# EAGLE design CanLogger_V2 (EAGLE 7.4.0)
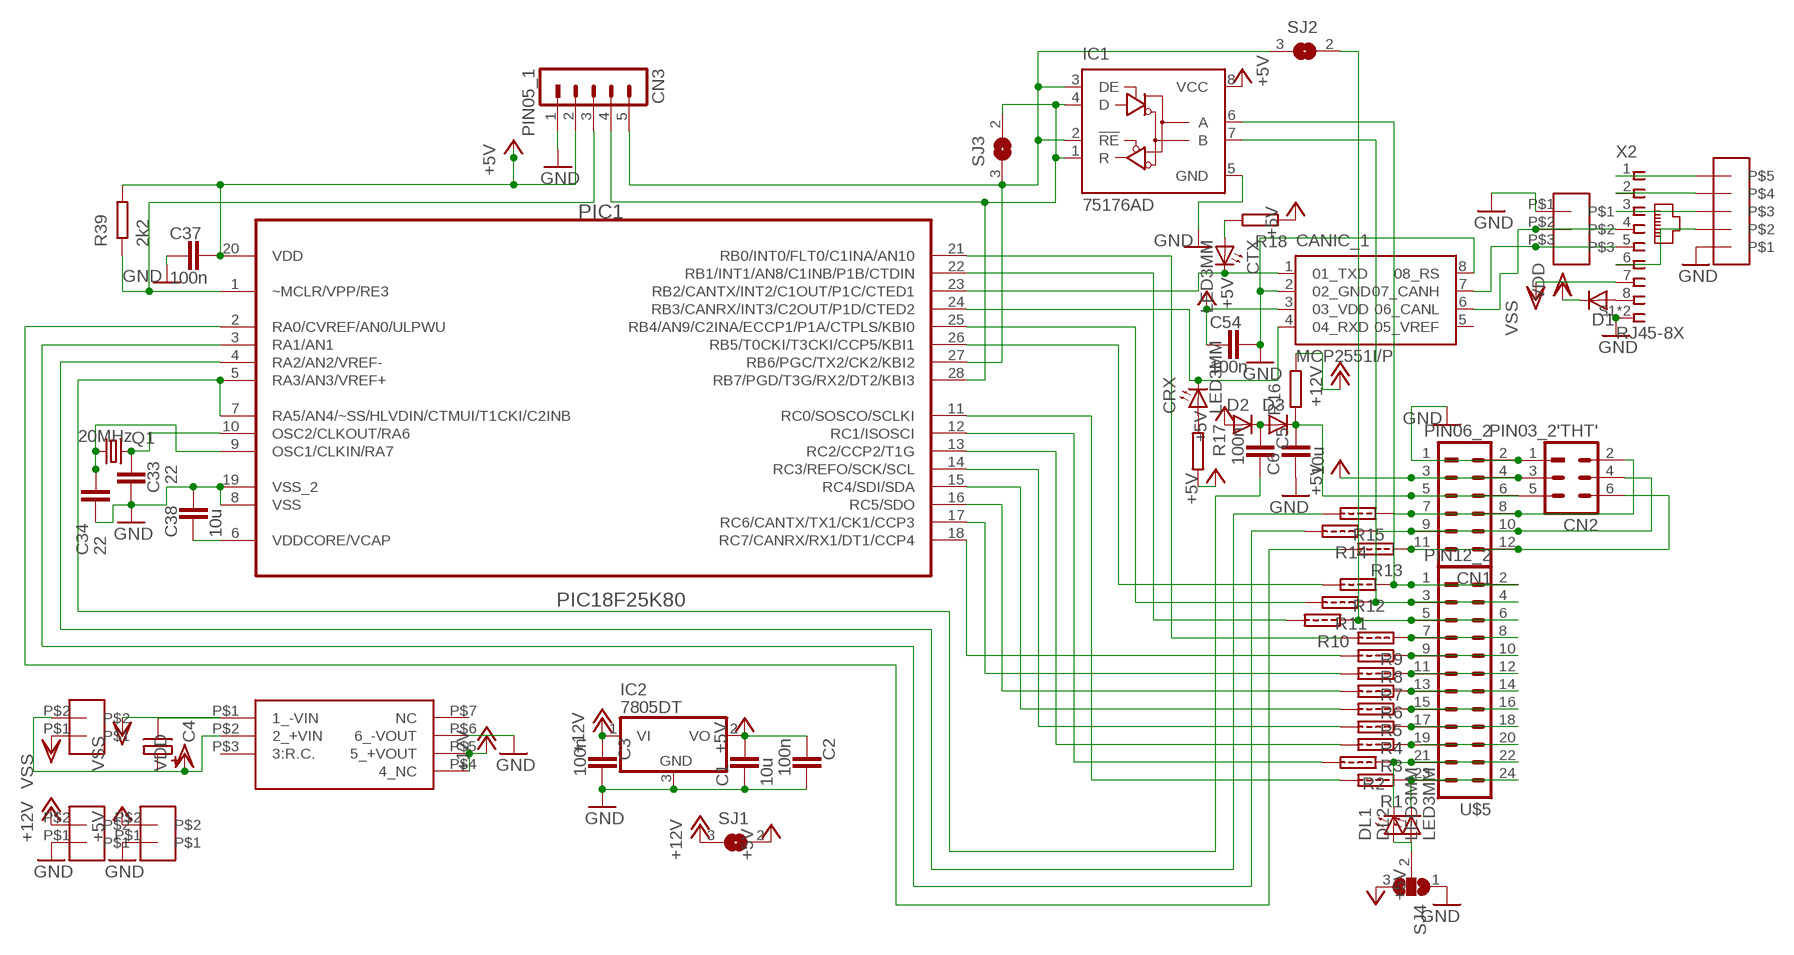
[diagram p0: schematic, sheet 1]

## Parts
C1  10u  C0805  [R0805]
C2  100n  C0805  [R0805]
C3  100n  C0805  [R0805]
C4  C_EL1R05  [C_EL1RASZT05]
C5  100n  C0805  [R0805]
C6  10u  C0805  [R0805]
C33  22  C0805  [R0805]
C34  22  C0805  [R0805]
C37  100n  C0805  [R0805]
C38  10u  C0805  [R0805]
C54  100n  C0805  [R0805]
CANIC_1  MCP2551I/P  [DIL_8]
CN1  PIN06_2  [PIN06_2]
CN2  PIN03_2'THT'  [PIN03_2]
CN3  PIN05_1  [PIN05_1]
CN_CAN  FEHER_TUS_3  [FEHER_TUS_3]
CRX  LED3MM  [LED3MM]
CTX  LED3MM  [LED3MM]
D1  D1R  [D1RASZT]
D2  D0805  [D0805]
D3  D0805  [D0805]
DL1  LED3MM  [LED3MM]
DL2  LED3MM  [LED3MM]
IC1  75176AD  [D_R-PDSO-G8]
IC2  7805DT  [TO252]
PIC1  PIC18F25K80  [SOIC127P1030X265-28N]
Q1  20MHz  XTAL_2QS  [XTAL_QS]
R1  RNULL_EU0805  [R0805_C]
R2  RNULL_EU0805  [R0805_C]
R3  RNULL_EU0805  [R0805_C]
R4  RNULL_EU0805  [R0805_C]
R5  RNULL_EU0805  [R0805_C]
R6  RNULL_EU0805  [R0805_C]
R7  RNULL_EU0805  [R0805_C]
R8  RNULL_EU0805  [R0805_C]
R9  RNULL_EU0805  [R0805_C]
R10  RNULL_EU0805  [R0805_C]
R11  RNULL_EU0805  [R0805_C]
R12  RNULL_EU0805  [R0805_C]
R13  RNULL_EU0805  [R0805_C]
R14  RNULL_EU0805  [R0805_C]
R15  RNULL_EU0805  [R0805_C]
R16  R_EU0805  [R0805]
R17  R_EU0805  [R0805]
R18  R_EU0805  [R0805]
R39  2k2  R_EU0805  [R0805]
SJ1  SJ  [SJ]
SJ2  SJ  [SJ]
SJ3  SJ  [SJ]
SJ4  SJ2W  [SJ2]
U$1  FEHER_TUS_5  [FEHER_TUS_5]
U$2  FEHER_TUS_2ALLO  [FEHER_TUS_2]
U$3  FEHER_TUS_2ALLO  [FEHER_TUS_2]
U$4  FEHER_TUS_2ALLO  [FEHER_TUS_2]
U$5  PIN12_2  [PIN12_2]
U$6  SPA02C  [SPA02C]
X2  RJ45-8X  [RJ45]

## Nets
+5V: C1.1 C2.2 C37.1 C54.2 CANIC_1.3(03_VDD) CN1.3 CN1.4 CN2.3 CN3.2 D2.1(A) IC1.8(VCC) IC2.2(VO) PIC1.20(VDD) R17.2(E) R18.1(A) R39.2(E) SJ1.2 SJ4.3 U$4.P$2
+12V: C3.2 IC2.1(VI) R16.2(E) SJ1.3 U$3.P$2 U$6.P$4(4_NC) U$6.P$5(5_+VOUT)
GND: C1.2 C2.1 C3.1 C6.2 C33.2 C34.2 C37.2 C38.1 C54.1 CANIC_1.2(02_GND) CANIC_1.8(08_RS) CN1.1 CN1.2 CN2.1 CN3.1 CN_CAN.P$1 IC1.5(GND) IC2.3(GND) PIC1.8(VSS) PIC1.19(VSS_2) SJ4.1 U$1.P$1 U$3.P$1 U$4.P$1 U$6.P$6(6_-VOUT) X2.S1(S) X2.S2(S)
N$1: CANIC_1.7(07_CANH) CN_CAN.P$3 X2.5
N$2: IC1.7(B) R11.1(A) U$5.3 U$5.4
N$3: CANIC_1.6(06_CANL) CN_CAN.P$2 X2.4
N$4: CN3.3 PIC1.1(~MCLR/VPP/RE3) R39.1(A)
N$5: IC1.6(A) R12.1(A) U$5.1 U$5.2
N$6: R10.1(A) SJ2.2 U$5.5 U$5.6
N$7: CANIC_1.1(01_TXD) CTX.K(C) PIC1.23(RB2/CANTX/INT2/C1OUT/P1C/CTED1)
N$8: D1.P$1(A) X2.8
N$9: DL1.K(C) R2.1(A) U$5.21 U$5.22
N$10: R3.1(A) U$5.19
N$11: R4.1(A) U$5.17 U$5.18
N$12: R5.1(A) U$5.15 U$5.16
N$13: DL1.A DL2.A SJ4.2
N$14: R6.1(A) U$5.13 U$5.14
N$15: R7.1(A) U$5.11 U$5.12
N$16: R8.1(A) U$5.9 U$5.10
N$17: R9.1(A) U$5.7 U$5.8
N$18: CRX.A R17.1(A)
N$19: CTX.A R18.2(E)
N$20: CN1.11 CN1.12 CN2.6 R13.1(A)
N$21: CN1.9 CN1.10 CN2.4 R14.1(A)
N$22: CN1.7 CN1.8 CN2.2 R15.1(A)
N$23: C5.2 D2.2(C) D3.1(A)
N$24: C6.1 CN1.5 CN1.6 CN2.5 D3.2(C) R16.1(A)
N$31: DL2.K(C) R1.1(A) U$5.23 U$5.24
N$32: PIC1.26(RB5/T0CKI/T3CKI/CCP5/KBI1) R12.2(E)
N$33: PIC1.18(RC7/CANRX/RX1/DT1/CCP4) R8.2(E)
N$34: PIC1.17(RC6/CANTX/TX1/CK1/CCP3) R7.2(E)
N$35: C33.1 PIC1.10(OSC2/CLKOUT/RA6) Q1.2
N$36: PIC1.16(RC5/SDO) R6.2(E)
N$37: PIC1.15(RC4/SDI/SDA) R5.2(E)
N$38: PIC1.14(RC3/REFO/SCK/SCL) R4.2(E)
N$39: PIC1.13(RC2/CCP2/T1G) R3.2(E)
N$40: PIC1.12(RC1/ISOSCI) R2.2(E)
N$41: PIC1.11(RC0/SOSCO/SCLKI) R1.2(E)
N$43: CANIC_1.4(04_RXD) CRX.K(C) PIC1.24(RB3/CANRX/INT3/C2OUT/P1D/CTED2)
N$44: PIC1.4(RA2/AN2/VREF-) R15.2(E)
N$45: C5.1 PIC1.5(RA3/AN3/VREF+) PIC1.7(RA5/AN4/~SS/HLVDIN/CTMUI/T1CKI/C2INB)
N$47: PIC1.21(RB0/INT0/FLT0/C1INA/AN10) R9.2(E)
N$48: PIC1.22(RB1/INT1/AN8/C1INB/P1B/CTDIN) R10.2(E)
N$49: U$1.P$5 X2.1
N$50: U$1.P$4 X2.2
N$51: U$1.P$3 X2.3
N$52: PIC1.2(RA0/CVREF/AN0/ULPWU) R13.2(E)
N$53: U$1.P$2 X2.6
N$54: PIC1.3(RA1/AN1) R14.2(E)
N$55: PIC1.25(RB4/AN9/C2INA/ECCP1/P1A/CTPLS/KBI0) R11.2(E)
N$56: U$5.20
N$81: C34.1 PIC1.9(OSC1/CLKIN/RA7) Q1.1
N$188: CN3.5 IC1.2(!RE) IC1.3(DE) PIC1.27(RB6/PGC/TX2/CK2/KBI2) SJ2.3 SJ3.3
N$223: C38.2 PIC1.6(VDDCORE/VCAP)
N$357: CN3.4 IC1.1(R) IC1.4(D) PIC1.28(RB7/PGD/T3G/RX2/DT2/KBI3) SJ3.2
VDD: C4.P+ D1.P$2(C) U$2.P$2 U$6.P$2(2_+VIN)
VSS: C4.P- U$2.P$1 U$6.P$1(1_-VIN) X2.7
Unconnected: CANIC_1.5(05_VREF) U$6.P$3(3:R.C.) U$6.P$7(NC)

## Library data of the parts
C1-C3 C5 C6 C33 C34 C37 C38 C54 = Cf_RLCPX:C
C4 = Cf_RLCPX:C_EL
CANIC_1 = Cf_UC:MCP2551
CN1 = Cf_Csatl:PIN06_2
CN2 = Cf_Csatl:PIN03_2
CN3 = Cf_Csatl:PIN05_1
CN_CAN = csatik:FEHER_TUS_3
CRX CTX DL1 DL2 = Cf_Felv:LED
D1-D3 = Cf_Felv:D
IC1 = narval:75176A: DIFFERENTIAL BUS TRANSCEIVER Source: http://focus.ti.com/lit/ds/symlink/sn75176a.pdf
IC2 = narval:78*: Positive VOLTAGE REGULATOR Source: http://cache.national.com/ds/LM/LM78L05.pdf http://www.fairchildsemi.com/ds/LM/LM7805.pdf
PIC1 = narval:PIC18F25K80
Q1 = Cf_RLCPX:XTAL_2
R1-R15 = Cf_RLCPX:RNULL_EU
R16-R18 R39 = Cf_RLCPX:R_EU
SJ1-SJ3 = jumper2:SJ: SMD solder JUMPER
SJ4 = jumper:SJ2W: SMD solder JUMPER
U$1 = csatik:FEHER_TUS_5
U$2-U$4 = csatik:FEHER_TUS_2
U$5 = Cf_Csatl:PIN12_2
U$6 = narval:SPA02C
X2 = Cf_Csatl:RJ45: CORCOM Modular RJ Jacks No Shield Source: www.tycoelectronics.com .. ENG_DS_1654001_1099_RJ_L_0507.pdf; MPN: RJ45-8X; OC_FARNELL: unknown; OC_NEWARK: 16R6101

## Net classes
0 default: width 0.305 mm, drill 0.61 mm, clearance 0.305 mm

## Board
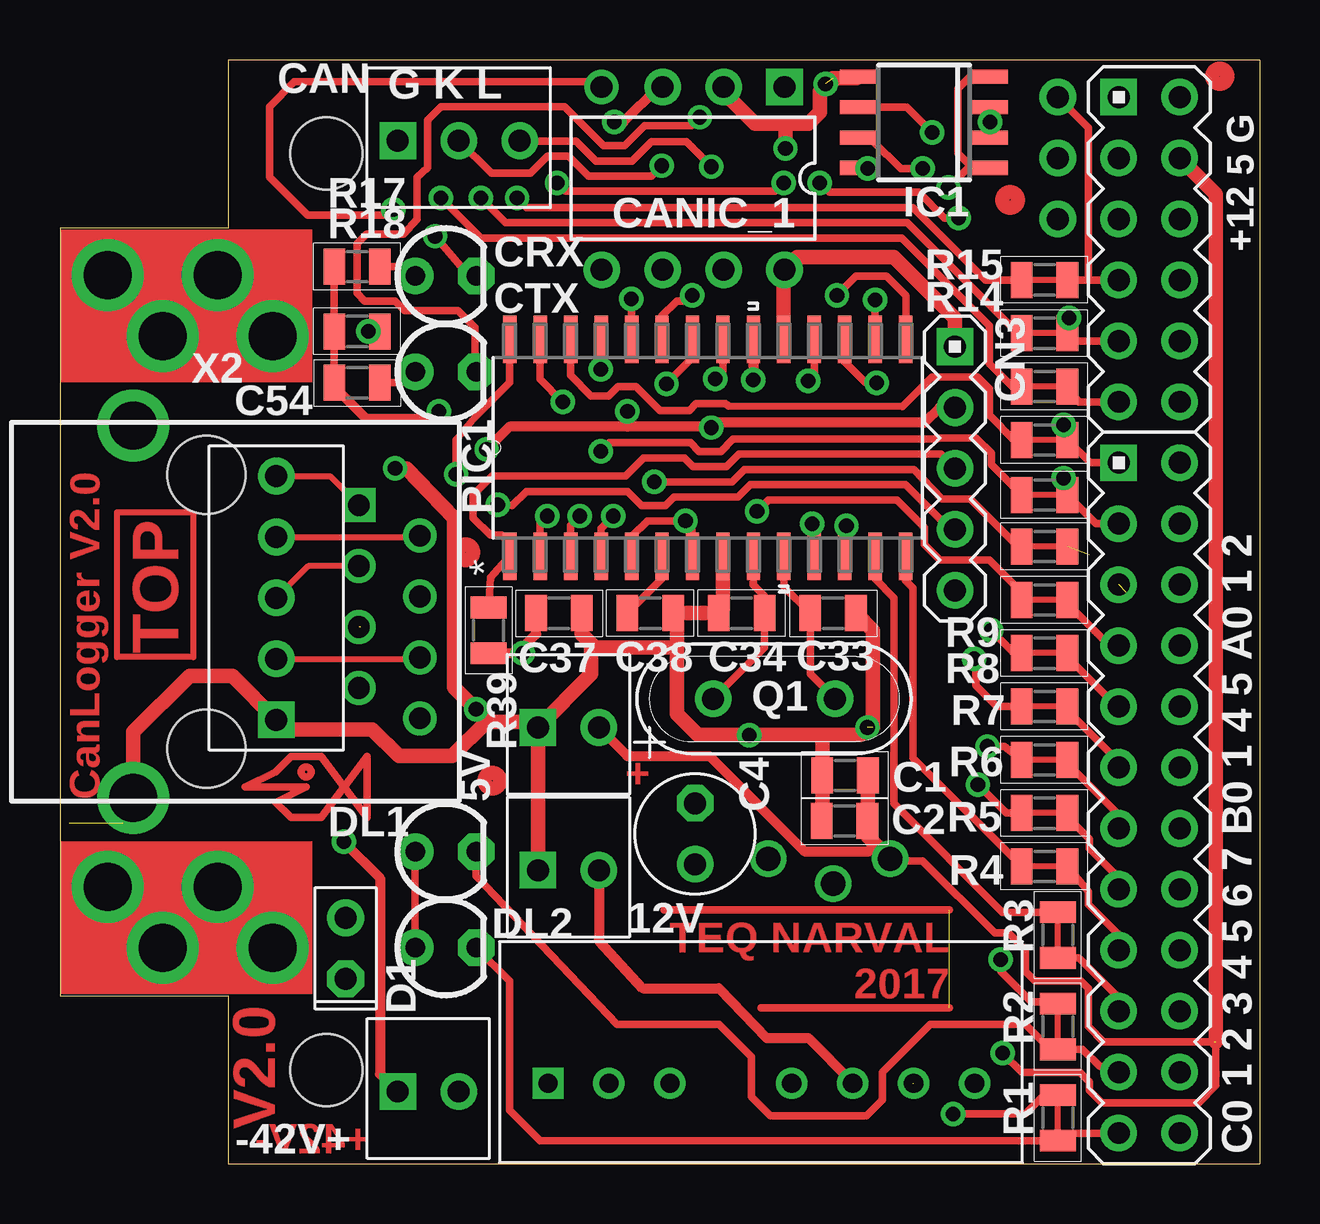
[diagram p1: board, top side]
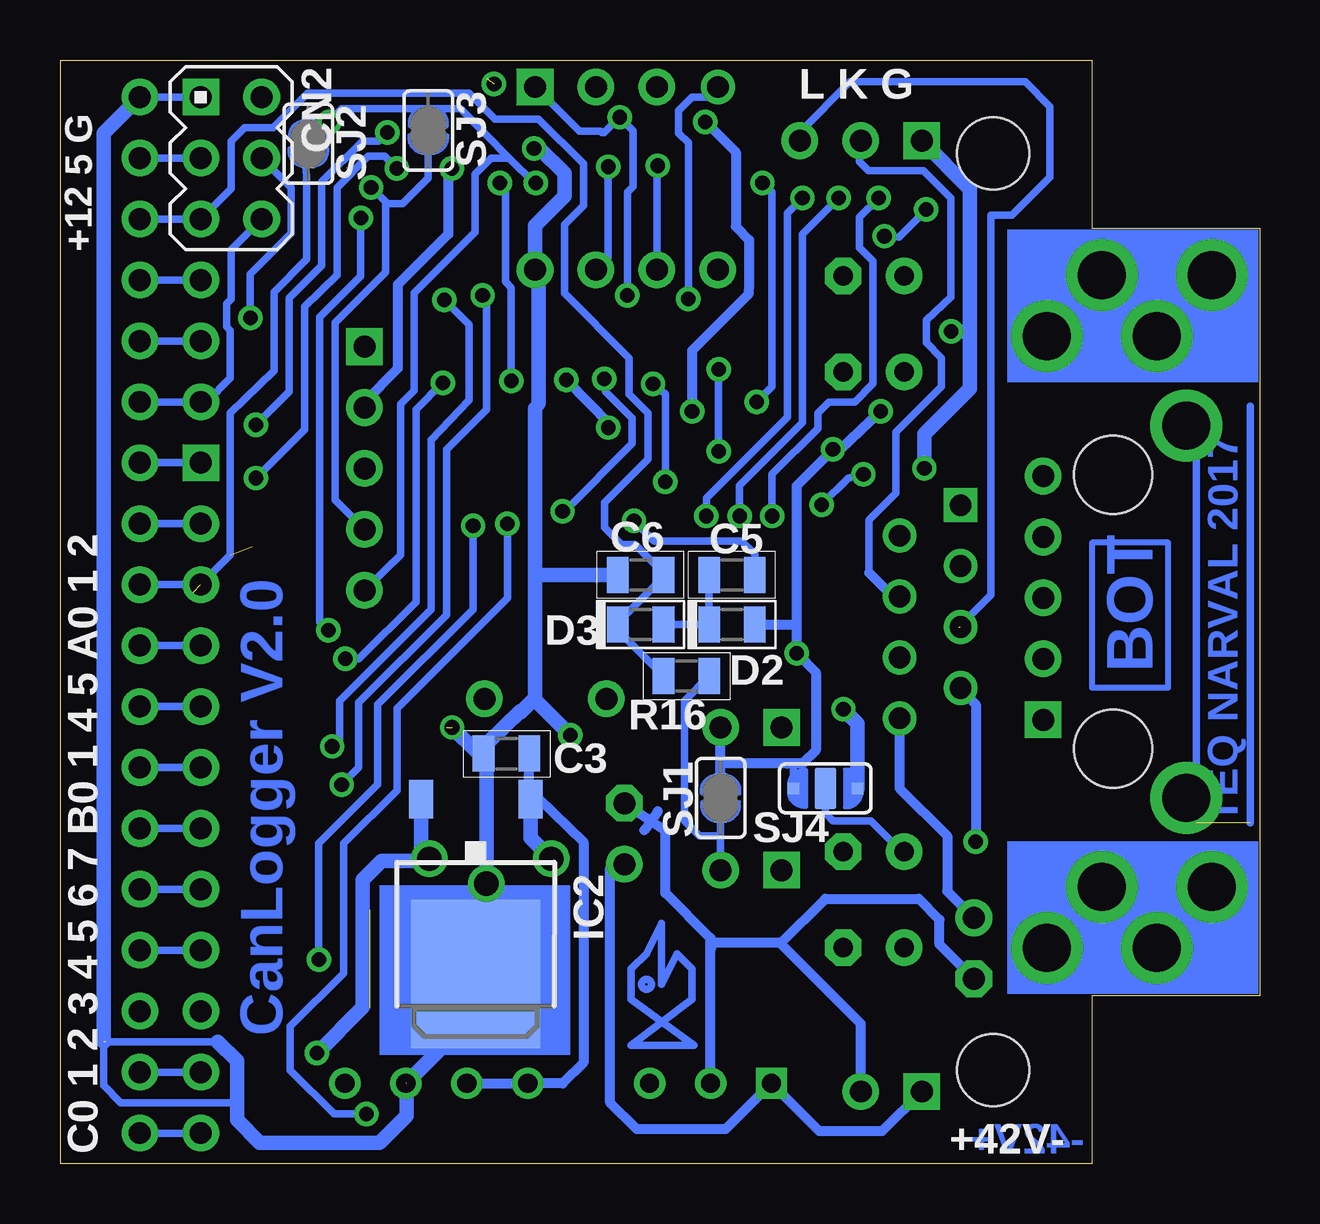
[diagram p2: board, bottom side, seen from below]

Size 50 x 46 mm. Coordinates in mm from the lower left corner, seen from the top.
Outline: 7,0 50,0 50,46 7,46 7,39 0,39 0,7 7,7 7,0
Copper layers (1*16): Top 0.035mm / dielectric 1.5mm / Bottom 0.035mm
Design rules "default *": minimum track width 10mil, minimum drill 24mil, track to track 12mil, track to pad 12mil, pad to pad 12mil, via to via 1mil, smd to smd 0mil, copper to edge 24mil, drill to drill 8mil, minimum pad ring 10mil, minimum via ring 8mil, stop-mask expansion 4mil, vias tented up to drill 0mil, thermal gap 10mil
Holes 3 mm at 11.1,3.9 11.1,42.1

### Footprints (pad centres in the part's own frame; a part is rotated, then mirrored left to right if it is on the bottom)
R0805 = smd 0.9 x 1.5: 1 -0.953,0; 2 0.953,0
C_EL1RASZT05 = drill 0.914 pad 1.524 octagon: P+ 1.27,0 | drill 0.914 pad 1.524: P- -1.27,0
DIL_8 = drill 0.914 pad 1.524 square: 1 -3.81,-3.81 | drill 0.914 pad 1.524: 2 -1.27,-3.81; 3 1.27,-3.81; 5 3.81,3.81; 6 1.27,3.81; 7 -1.27,3.81; 8 -3.81,3.81 | drill 0.914: 4 3.81,-3.81
PIN06_2 = drill 0.914 pad 1.524 square: 1 -5.08,0 | drill 0.914 pad 1.524: 2 -5.08,2.54; 3 -2.54,0; 4 -2.54,2.54; 5 0,0; 6 0,2.54; 7 2.54,0; 8 2.54,2.54; 9 5.08,0; 10 5.08,2.54; 11 7.62,0; 12 7.62,2.54
PIN03_2 = drill 0.914 pad 1.524 square: 1 -2.54,0 | drill 0.914 pad 1.524: 2 -2.54,2.54; 3 0,0; 4 0,2.54; 5 2.54,0; 6 2.54,2.54
PIN05_1 = drill 0.914 pad 1.524 square: 1 -5.08,0 | drill 0.914 pad 1.524: 2 -2.54,0; 3 0,0; 4 2.54,0; 5 5.08,0
FEHER_TUS_3 = drill 0.914 pad 1.524 square: P$1 0,0 | drill 0.914 pad 1.524: P$2 2.54,0; P$3 5.08,0
LED3MM = drill 0.813 pad 1.524: A -1.27,0 | drill 0.813 pad 1.524 octagon: K 1.27,0
D1RASZT = drill 0.914 pad 1.524: P$1 -1.27,0 | drill 0.914 pad 1.524 octagon: P$2 1.27,0
D0805 = smd 0.9 x 1.5: 1 -0.953,0; 2 0.953,0
D_R-PDSO-G8 = smd 0.6 x 1.5: 1 -1.905,-2.75; 2 -0.635,-2.75; 3 0.635,-2.75; 4 1.905,-2.75; 5 1.905,2.75; 6 0.635,2.75; 7 -0.635,2.75; 8 -1.905,2.75
TO252 = smd 1 x 1.6: 1 -2.28,-4.8; 2 2.28,-4.8 | smd 5.4 x 6.2: 3 0,2.5
SOIC127P1030X265-28N = smd 1.981 x 0.559: 1 -4.521,8.255; 2 -4.521,6.985; 3 -4.521,5.715; 4 -4.521,4.445; 5 -4.521,3.175; 6 -4.521,1.905; 7 -4.521,0.635; 8 -4.521,-0.635; 9 -4.521,-1.905; 10 -4.521,-3.175; 11 -4.521,-4.445; 12 -4.521,-5.715; 13 -4.521,-6.985; 14 -4.521,-8.255; 15 4.521,-8.255; 16 4.521,-6.985; 17 4.521,-5.715; 18 4.521,-4.445; 19 4.521,-3.175; 20 4.521,-1.905; 21 4.521,-0.635; 22 4.521,0.635; 23 4.521,1.905; 24 4.521,3.175; 25 4.521,4.445; 26 4.521,5.715; 27 4.521,6.985; 28 4.521,8.255
XTAL_QS = drill 0.914 pad 1.524: 1 -2.54,0; 2 2.54,0
R0805_C = smd 0.9 x 1.5: 1 -0.953,0; 2 0.953,0
SJ = smd 0.508 x 0.508: 1 -0.762,0; 2 0.762,0; 3 -0.762,0; 4 0.762,0
SJ2 = smd 0.508 x 0.508: 1 -1.333,0; 3 1.333,0 | smd 0.889 x 1.714: 2 0,0
FEHER_TUS_5 = drill 0.914 pad 1.524 square: P$1 5.08,0 | drill 0.914 pad 1.524: P$2 2.54,0; P$3 0,0; P$4 -2.54,0; P$5 -5.08,0
FEHER_TUS_2 = drill 0.914 pad 1.524 square: P$1 0,0 | drill 0.914 pad 1.524: P$2 2.54,0
PIN12_2 = drill 0.914 pad 1.524 square: 1 -12.7,0 | drill 0.914 pad 1.524: 2 -12.7,2.54; 3 -10.16,0; 4 -10.16,2.54; 5 -7.62,0; 6 -7.62,2.54; 7 -5.08,0; 8 -5.08,2.54; 9 -2.54,0; 10 -2.54,2.54; 11 0,0; 12 0,2.54; 13 2.54,0; 14 2.54,2.54; 15 5.08,0; 16 5.08,2.54; 17 7.62,0; 18 7.62,2.54; 19 10.16,0; 20 10.16,2.54; 21 12.7,0; 22 12.7,2.54; 23 15.24,0; 24 15.24,2.54
SPA02C = drill 0.8 square: P$1 2.024,3.294 | drill 0.8: P$2 4.564,3.294; P$3 7.104,3.294; P$4 12.184,3.294; P$5 14.724,3.294; P$6 17.264,3.294; P$7 19.804,3.294
RJ45 = drill 0.9 pad 1.4 square: 1 -4.445,6.35 | drill 0.9 pad 1.4: 2 -3.175,8.89; 3 -1.905,6.35; 4 -0.635,8.89; 5 0.635,6.35; 6 1.905,8.89; 7 3.175,6.35; 8 4.445,8.89 | drill 2: S1 -7.77,-3.05; S2 7.77,-3.05 | hole 3.251: -5.715,0; 5.715,0

### Placement (x,y rotation side)
C1  32.73,16.18 180 top
C2  32.7,14.29 0 top
C3  31.39,17.08 0 bottom
C4  26.47,13.74 90 top
C5  21.99,24.53 180 bottom
C6  25.8,24.53 180 bottom
C33  32.23,22.94 0 top
C34  28.42,22.94 180 top
C37  20.8,22.94 0 top
C38  24.61,22.94 180 top
C54  12.38,34.69 180 top
CANIC_1  26.39,41.07 180 top
CN1  44.13,39.37 270 top
CN2  44.13,41.91 270 bottom
CN3  37.31,28.97 270 top
CN_CAN  14.08,42.63 0 top
CRX  16.08,37 0 top
CTX  16.08,33 0 top
D1  11.91,8.97 270 top
D2  21.99,22.46 180 bottom
D3  25.8,22.46 180 bottom
DL1  16.08,13 0 top
DL2  16.08,9 0 top
IC1  36.02,43.4 90 top
IC2  32.67,10.39 180 bottom
PIC1  27,29.84 90 top
Q1  29.77,19.37 0 top
R1  41.59,1.91 90 top
R2  41.59,5.71 90 top
R3  41.59,9.53 90 top
R4  41.04,12.38 180 top
R5  41.04,14.61 180 top
R6  41.04,16.83 180 top
R7  41.04,19.05 180 top
R8  41.04,21.27 180 top
R9  41.04,23.5 180 top
R10  41.04,25.72 180 top
R11  41.04,27.86 180 top
R12  41.04,30.16 180 top
R13  41.04,32.38 180 top
R14  41.04,34.61 180 top
R15  41.04,36.83 180 top
R16  23.89,20.32 0 bottom
R17  12.38,37.39 180 top
R18  12.38,32.54 0 top
R39  17.86,22.23 270 top
SJ1  22.46,15.24 90 bottom
SJ2  39.65,42.51 270 bottom
SJ3  34.65,43.06 270 bottom
SJ4  18.1,15.64 180 bottom
U$1  9.02,23.57 270 top
U$2  14.08,3 0 top
U$3  19.92,12.22 0 top
U$4  19.92,18.18 0 top
U$5  44.13,16.51 270 top
U$6  18.32,0.05 0 top
X2  6.11,23 270 top

### Tracks (layer width: path | path; a pad name or v marks a point on that pad's centre or on a via)
+5V  (via drill 0.61, 1.02)  (1 unrouted)
  Top 0.305: v39.29,4.6 40.08,3.81 42.51,3.81 42.9,3.41 42.9,3.06 43.42,2.54 47.47,2.54 48.18,3.25 48.18,5.08 | R17.2 C54.2 R18.1 | 34.92,12.62 35.96,12.62 38.97,9.6 39.53,9.6 40.24,8.89 40.24,8.02 40.64,7.62 42.55,7.62 42.86,7.3 42.86,5.71 43.5,5.08 48.1,5.08
  Top 0.406: CN3.2 36.67,31.51 36.03,30.88 27.3,30.88 27.27,30.8 v27.15,30.68 26.99,30.72 23.65,30.72 | R39.2 v19.29,21.27 19.29,21.51 19.84,22.07 C37.1 | PIC1.20 28.91,33.27 v28.89,32.66 | 23.65,30.72 18.73,30.72 v17.78,29.77 | v33.66,41.47 33.21,41.43 IC1.8 | CANIC_1.3 25.09,44.85 24.92,44.85 23.5,43.42 v23.1,43.42 | v23.65,31.35 23.65,30.72 | U$4.P$2 23.65,16.99 27.07,16.99 31.04,13.02 33.73,13.02 33.93,13.38 | v15.8,31.35 15.48,31.04 12.78,31.04 11.43,32.38 R18.1
  Top 0.61: C1.1 33.68,13.83 C2.2 33.66,13.65 33.93,13.38 34.69,12.62 34.92,12.62 v34.61,12.7 | CN1.4 48.18,40.4 48.18,5.08
  Bottom 0.305: CN2.3 CN1.4 | SJ4.3 19.43,16.65 19.68,16.67
  Bottom 0.406: SJ1.2 22.46,16.67 | 19.29,22.46 v19.29,21.27 18.49,20.48 18.49,17.22 19.05,16.67 19.68,16.67 22.46,16.67 | 19.29,22.46 19.29,28.26 v17.78,29.77 17.46,29.77 v15.8,31.35 | v28.89,32.66 27.07,30.8 v27.15,30.68 | D2.1 19.29,22.46 | v23.1,43.42 21.83,42.15 21.83,39.05 21.27,38.5 21.27,36.67 21.31,36.23 23.65,33.89 v23.65,31.35 | v33.66,41.47 33.82,41.31 33.82,38.73 35.91,36.65 35.91,33.15 37.31,31.75 CN3.2 | 22.46,16.67 U$4.P$2
  Bottom 0.61: IC2.2 34.95,12.67 v34.61,12.7 34.92,13.02 | v39.29,4.6 37.39,6.51 37.39,11.83 36.59,12.62 35.24,12.62
+12V  (via drill 1.02)
  Top 0.406: U$3.P$2 22.46,9.29 24.29,7.3 27.46,7.3 29.45,5.24 31.19,5.24 33.04,3.39 U$6.P$5
  Bottom 0.305: C3.2 30.43,15.19 | R16.2 23.97,19.29 23.97,14.29 23.34,13.65 22.46,13.65 | SJ1.3 22.46,13.65 | 22.46,13.65 U$3.P$2
  Bottom 0.406: 30.43,15.19 IC2.1 | C3.2 30.44,15.28 30.4,15.24 30.08,15.24 28.18,13.41 28.18,4.21 29.04,3.34 U$6.P$4 U$6.P$5
  Bottom 0.61: v29.53,12.7 30.39,13.56 IC2.1
GND  (via drill 0.61, 1.02)  (3 unrouted)
  Top 0.305: C38.1 25.72,22.78 | C34.2 27.64,23.11
  Top 0.61: C33.2 33.89,22.23 33.89,18.18 | 31.67,17.86 v28.73,17.86 26.59,17.86 25.72,18.73 25.72,21.51 | 25.72,21.51 25.72,22.78 | C34.2 C38.1 | 27.64,23.11 PIC1.8 | C37.2 21.75,22.07 22.15,21.67 | 22.15,21.67 22.3,21.51 25.72,21.51 | U$4.P$1 U$3.P$1 | U$4.P$1 22.15,20.4 22.15,21.67 | PIC1.19 30.16,34.38 30.16,37.22 CANIC_1.8 30.73,37.78 34.77,37.78 37.31,35.24 CN3.1 | CANIC_1.2 27.66,44.65 28.97,43.34 30.16,43.34 | 30.16,43.34 31.19,43.34 31.67,43.81 31.67,44.69 32.23,45.24 33.21,45.24 IC1.5 | 17.86,18.41 v17.34,18.93 16.43,19.84 16.43,26.91 14.45,28.97 v13.97,28.97 | 17.86,18.41 19.68,18.41 U$4.P$1 | v30.24,42.31 30.24,43.26 30.16,43.34 | C2.1 31.77,13.83 C1.2 31.77,17.76 31.67,17.86 | C54.1 v12.86,34.69 | X2.S2 3.06,17.98 5.4,20.32 7.19,20.32 U$1.P$1 9.05,18.5 9.45,18.1 13.02,18.1 14.13,16.99 16.35,16.99 17.78,18.41 17.86,18.41 | v33.66,18.18 33.34,17.86 31.67,17.86
  Bottom 0.305: CN2.1 CN1.2 | 43.42,5.08 48.1,5.08 | 42.62,2.54 47.47,2.54 48.18,3.25 48.18,5.08
  Bottom 0.61: U$6.P$6 32.67,6.25 IC2.3 32.23,8.34 v32.23,11.67 32.23,16.97 C3.1 | C3.1 32.34,17.34 32.15,17.54 30.8,18.87 30.8,18.81 30.24,19.37 | 30.24,19.37 30.2,19.41 30.2,24.53 | 30.2,24.53 30.2,31.47 30.04,31.67 30.04,37.1 CANIC_1.8 30.2,39.09 28.97,40.32 28.97,41.27 30,42.31 v30.24,42.31 | v28.73,17.86 30.24,19.37 | C6.2 30.2,24.53 | CN_CAN.P$1 12.06,40.62 12.06,34.77 | 12.06,34.77 12.06,32.31 13.97,30.4 v13.97,28.97 | v12.86,34.69 12.14,34.69 12.06,34.77 | 35.56,3.33 35.56,1.98 36.67,0.87 41.67,0.87 42.62,1.83 42.62,2.54 42.62,4.29 43.42,5.08 | 48.18,5.08 48.18,42.94 CN1.2 | SJ4.1 16.76,18.35 v17.34,18.93 | v33.66,18.18 32.56,17.08 C3.1
  other vias: 31.91,45.01
HALACSKA9
  Bottom 0.305: 26.19,4.93 23.57,4.93 26.19,6.83 26.19,8.11 25.56,8.74 24.92,10.01 24.92,7.47 24.29,8.74 23.65,8.11 23.65,6.83 26.19,4.93
HALACSKA14
  Top 0.305: 12.8,16.97 12.8,14.43 10.89,16.97 9.62,16.97 8.99,16.33 7.72,15.7 10.26,15.7 8.99,15.06 9.62,14.43 10.89,14.43 12.8,16.97
N$1  (via drill 0.61)  (1 unrouted)
  Top 0.305: CN_CAN.P$3 21.51,42.62 22.34,41.79 23.85,41.79 24.65,42.59 26.11,42.59 v27.15,41.55
  Bottom 0.305: v27.15,41.55 27.15,37.77 CANIC_1.7 | CN_CAN.P$3 19.16,42.99 17.07,45.09 9.76,45.09 8.73,44.05 8.73,41.12 10.32,39.53 11.19,39.53 11.19,23.7 12.52,22.36
N$2  (via drill 0.61)
  Top 0.305: U$5.3 43.18,26.67 R11.1 41.99,28.38 v41.83,28.57 | IC1.7 33.4,42.62 33.89,42.62 35.04,41.47 v35.96,41.47
  Bottom 0.305: v41.83,28.57 39.81,30.6 39.81,35.72 38.46,37.03 38.46,40.68 37.15,41.99 36.47,41.99 v35.96,41.47 | U$5.3 U$5.4
N$3  (via drill 0.61)
  Top 0.305: CN_CAN.P$2 17.98,41.27 19.61,41.27 20.32,41.99 21.19,41.99 22.03,41.16 24.65,41.16 v25.08,41.59
  Bottom 0.305: v25.08,41.59 25.12,41.24 CANIC_1.6 | 16.27,24.63 16.27,26.83 15.16,27.94 15.16,30.48 13.26,32.38 13.26,33.58 13.89,34.21 13.89,35.16 12.86,36.12 12.86,40.24 14.01,41.39 16.31,41.39 16.67,41.75 16.67,42.59 CN_CAN.P$2 16.6,42.63
  Bottom 0.406: 16.27,24.63 15.28,23.64 X2.4
N$4
  Top 0.305: R39.1 17.94,24.43 PIC1.1 18.75,25.78 18.49,26.11 18.41,26.19 17.94,26.19 17.22,26.91 17.22,27.86 18.02,28.65 23.57,28.65 24.33,29.41 26.04,29.41 26.39,29.05 27.78,29.05 28.3,29.57 36.71,29.57 CN3.3
N$5  (via drill 0.61)
  Top 0.305: U$5.1 42.94,29.21 R12.1 41.99,30.68 v41.83,30.8 | IC1.6 35.3,44.03 v36.35,42.98
  Bottom 0.305: v41.83,30.8 40.44,32.19 40.44,36.08 39.09,37.42 39.09,40.92 37.39,42.62 36.71,42.62 v36.35,42.98 | U$5.1 U$5.2
N$6  (2 unrouted)
  Bottom 0.305: SJ2.2 39.77,41.75 39.73,41.12 39.73,37.7 41.08,36.31 41.08,33.06 42.9,31.27 42.9,25.36 U$5.5 | U$5.6 44.77,24.13 44.45,23.81
N$7  (via drill 0.61)
  Top 0.305: 25.08,34.38 25.08,35.32 25.72,35.96 26.11,35.96 v26.35,36.2 | v26.67,43.62 26.31,43.26 24.37,43.26 23.54,42.43 22.66,42.43 21.03,44.05 15.88,44.05 15.32,43.5 15.32,41.51 14.88,41.12 14.88,39.37 14.33,38.73 12.78,38.73 12.38,38.34 12.38,36.27 12.7,35.96 13.97,35.96 14.37,35.56 16.59,35.56 17.3,34.85 17.3,33.02 CTX.K
  Top 0.406: 25.08,34.38 PIC1.23
  Bottom 0.305: CANIC_1.1 28.34,43.02 27.46,43.02 27.41,42.96 27.32,42.96 v26.67,43.62 26.11,43.06 26.11,40.72 26.35,40.48 v26.35,36.2
N$8
  Bottom 0.406: X2.8 15,15.64 13.02,13.65 13.02,11.35 D1.P$1
N$9
  Top 0.305: U$5.21 43.89,4.05 43.34,4.05 42.62,4.76 R2.1 41.27,4.76 40.24,5.79 36.27,5.79 34.29,3.81 34.29,2.66 33.62,1.98 29.61,1.98 28.81,2.78 28.81,4.45 27.46,5.79 23.22,5.79 17.34,11.99 DL1.K
  Bottom 0.305: U$5.22 U$5.21
N$10
  Top 0.305: U$5.19 44.13,6.91 42.47,8.57 R3.1
N$11
  Top 0.305: U$5.17 44.13,9.53 42.86,10.79 42.86,11.35 R4.1
  Bottom 0.305: U$5.18 U$5.17
N$12
  Top 0.305: U$5.15 44.13,11.91 42.9,13.14 42.9,13.53 41.99,14.45 R5.1
  Bottom 0.305: U$5.16 U$5.15
N$13
  Top 0.305: DL2.A DL1.A
  Bottom 0.305: DL1.A 14.9,13 16.19,14.29 17.78,14.29 18.1,14.61 SJ4.2
N$14
  Top 0.305: U$5.13 44.13,14.53 41.99,16.67 R6.1
  Bottom 0.305: U$5.14 U$5.13
N$15
  Top 0.305: U$5.11 44.13,16.75 41.99,18.89 R7.1
  Bottom 0.305: U$5.12 U$5.11
N$16
  Top 0.305: U$5.9 44.05,19.05 41.99,21.11 R8.1
  Bottom 0.305: U$5.10 U$5.9
N$17
  Top 0.305: U$5.7 43.74,21.59 41.99,23.34 R9.1
  Bottom 0.305: U$5.8 U$5.7
N$18
  Top 0.305: R17.1 14.42,37.39 CRX.A
N$19
  Top 0.305: R18.2 14.35,32.54 CTX.A
N$20
  Top 0.305: CN1.11 42.47,31.75 R13.1
  Bottom 0.305: CN1.12 CN1.11 43.89,31.75 42.9,32.74 42.9,34.73 43.06,34.88 43.06,35.84 42.86,36.04 42.86,38.1 CN2.6
N$21  (via drill 0.61)
  Top 0.305: CN1.9 42.15,34.29 R14.1 41.99,35.16 v42.07,35.24
  Bottom 0.305: CN2.4 40.36,40.68 40.36,38.77 42.07,37.07 v42.07,35.24 | CN1.9 CN1.10
N$22
  Top 0.305: CN1.7 42.86,36.83 | 42.86,36.83 R15.1 | CN2.2 42.86,43.18 42.86,36.83
  Bottom 0.305: CN1.7 CN1.8
N$23
  Bottom 0.305: D3.1 D2.2 C5.2
N$24
  Bottom 0.305: C6.1 24.84,24.92 | C6.1 24.84,24.45 26.67,22.62 D3.2 26.75,22.23 R16.1 | CN1.6 CN2.5 42.86,40.64 42.86,42.62 42.31,43.18 41.12,43.18 39.69,44.61 32.94,44.61 31.87,43.54 30.04,43.54 28.18,41.67 28.18,39.93 28.97,39.13 28.97,36.27 26.27,33.58 26.27,32.07 25.48,31.27 25.48,29.37 27.3,27.54 27.3,26.51 26.59,25.8 26.04,25.8 25.24,25 25.08,25 C6.1
N$25  (via drill 2)
  other vias: 1.99,37.03
N$26  (via drill 2)
  other vias: 1.99,11.53
N$27  (via drill 2)
  other vias: 4.28,8.99
N$28  (via drill 2)
  other vias: 4.28,34.49
N$29  (via drill 2)
  other vias: 6.57,11.53
N$30  (via drill 2)
  other vias: 8.86,8.99
N$31
  Top 0.305: U$5.23 41.91,1.27 R1.1 20,0.95 18.73,2.22 18.73,7.62 DL2.K
  Bottom 0.305: U$5.24 U$5.23
N$32
  Top 0.305: R12.2 39.77,30.16 38.73,31.19 38.73,32.31 38.26,32.78 36.35,32.78 35.12,31.55 27.87,31.57 27.81,31.63 27.78,31.63 27.74,31.67 26.51,31.67 26.23,31.39 25,31.39 24.01,32.38 23.26,32.38 22.86,31.99 22.15,31.99 21.27,32.86 21.27,34.35 PIC1.26
N$33  (via drill 0.61)
  Top 0.305: R8.2 39.77,21.27 v38.81,22.23 | v31.19,32.62 31.45,32.85 PIC1.18 | v31.67,40.88 32.07,40.48 35.8,40.48 36.87,39.41 v37.47,39.41
  Bottom 0.305: v31.67,40.88 31.43,40.64 31.43,36.75 31.19,36.51 v31.19,32.62 | v37.47,39.41 37.47,36.99 39.17,35.28 39.17,22.58 v38.81,22.23
N$34  (via drill 0.61)
  Top 0.305: R7.2 39.05,19.05 38.18,19.92 38.18,20.95 v38.1,21.03 | v34.05,32.54 33.58,32.54 32.7,33.42 32.7,34.35 PIC1.17
  Bottom 0.305: v38.1,21.03 37.54,21.03 35.16,23.42 35.16,31.43 v34.05,32.54
N$35
  Top 0.305: Q1.2 31.27,20.4 C33.1 30.18,24.04 PIC1.10
N$36  (via drill 0.61)
  Top 0.305: R6.2 39.37,17.38 v38.66,17.38 | v33.97,36 33.97,34.38 PIC1.16
  Bottom 0.305: v38.66,17.38 38.34,17.7 38.34,19.29 34.53,23.1 34.53,30.16 32.94,31.83 32.94,34.97 v33.97,36
N$37  (via drill 0.61)
  Top 0.305: R5.2 39.45,14.61 v38.26,15.8 | v32.38,36.2 33.18,36.99 34.45,36.99 35.26,36.18 PIC1.15
  Bottom 0.305: v38.26,15.8 37.54,16.51 37.54,19.21 33.89,22.86 33.89,29.77 32.23,31.43 32.23,35.96 v32.38,36.2
N$38
  Top 0.305: PIC1.14 35.24,24.61 35.24,24.3 35.56,23.98 35.56,16.91 R4.2
N$39
  Top 0.305: PIC1.13 33.98,24.36 34.77,23.57 34.77,15 39.29,10.48 R3.2
N$40  (via drill 0.61)
  Top 0.305: PIC1.12 32.7,25.33 v32.78,26.59 | R2.2 41.51,6.75 40.96,6.75 40.48,6.75 39.21,8.02 v39.21,8.49
  Bottom 0.305: v32.78,26.59 32.78,23.1 36.75,19.13 36.75,15.8 39.21,13.34 v39.21,8.49
N$41  (via drill 0.61)
  Top 0.305: R1.2 41.04,2.86 40.24,2.06 v37.23,2.06 | v31.35,26.67 31.45,26.62 PIC1.11
  Bottom 0.305: v31.35,26.67 31.35,23.57 35.96,18.97 35.96,15.56 38.18,13.34 38.18,7.94 40.4,5.71 40.4,3.89 38.58,2.06 v37.23,2.06
N$42  (via drill 2)
  other vias: 6.57,37.03
N$43  (via drill 0.61)
  Top 0.305: PIC1.24 23.82,36.02 v23.81,36.04 | CANIC_1.4 22.39,45.09 9.76,45.09 8.73,44.05 8.73,41.12 10.32,39.53 13.57,39.53 13.81,39.77 v13.89,39.77 | CRX.K 17.05,37 v15.64,38.66
  Bottom 0.305: CANIC_1.4 23,44.45 23.65,44.45 24.21,43.89 24.21,42.94 23.81,42.55 v23.81,36.04 | v15.64,38.66 15.04,38.62 v13.89,39.77
N$44  (via drill 0.61)
  Top 0.305: R15.2 38.58,36.83 35.56,39.85 19.45,39.85 v19.05,40.24 | v23.06,26.99 22.54,26.47 22.54,25.33 PIC1.4
  Bottom 0.305: v19.05,40.24 19.68,39.61 19.68,31.11 23.06,27.74 v23.06,26.99
N$45  (via drill 0.61)
  Top 0.305: PIC1.5 23.82,26.13 24.49,26.79 v26.07,26.79 26.35,26.43 26.35,25.33 PIC1.7
  Bottom 0.305: C5.1 21.03,25.4 21.59,25.96 25.24,25.96 v26.07,26.79
N$46  (via drill 2)
  other vias: 8.86,34.49
N$47  (via drill 0.61)
  Top 0.305: R9.2 40.08,23.81 38.73,25.16 36.67,25.16 36.04,25.8 36.04,26.51 34.89,27.66 29.53,27.66 v29.05,27.19 | v27.3,32.7 27.64,33.03 PIC1.21
  Bottom 0.305: v27.3,32.7 27.27,32.38 27.27,32.19 26.15,31.07 26.15,30 28.97,27.19 v29.05,27.19
N$48  (via drill 0.61)
  Top 0.305: R10.2 39.93,25.72 37.94,27.7 36.75,27.7 35.6,28.93 28.53,28.93 28.02,28.42 v24.77,28.42 | v25.28,32.5 26.36,33.59 PIC1.22
  Bottom 0.305: v24.77,28.42 24.77,32.07 v25.28,32.5
N$49
  Top 0.254: U$1.P$5 11.25,28.66 X2.1
N$50
  Top 0.254: U$1.P$4 14.94,26.11 X2.2
N$51
  Top 0.254: X2.3 10.35,24.91 U$1.P$3
N$52  (via drill 0.61)
  Top 0.305: R13.2 39.69,32.38 38.73,33.34 38.73,34.92 35.08,38.58 17.54,38.58 v15.88,40.24 16.11,40.01 | v20.32,26.99 20.02,26.68 PIC1.2
  Bottom 0.305: v20.32,26.99 20.32,28.73 18.41,30.64 18.41,31.27 17.94,31.75 16.87,31.75 16.11,32.5 16.11,37.62 16.67,38.18 16.67,39.45 v15.88,40.24
N$53
  Top 0.254: U$1.P$2 14.94,21.04 X2.6
N$54  (via drill 0.61)
  Top 0.305: R14.2 39.93,34.61 35.32,39.21 18.57,39.21 v17.54,40.24 | v21.67,26.99 21.29,26.6 PIC1.3
  Bottom 0.305: v17.54,40.24 19.05,38.73 19.05,30.88 21.67,28.26 v21.67,26.99
N$55  (via drill 0.61)
  Top 0.305: R11.2 38.81,29.13 38.81,29.61 38.18,30.24 36.51,30.24 36.55,30.2 28.06,30.2 27.54,29.69 26.63,29.69 26.27,30.04 22.9,30.04 v22.54,29.69 | PIC1.25 v22.54,33.1
  Bottom 0.305: v22.54,33.1 v22.54,29.69
N$57
  Top 0.254: 2.38,21.11 2.38,27.15 5.56,27.15 5.56,21.11 2.38,21.11
N$58
  Bottom 0.254: 3.81,19.84 3.81,25.88 6.99,25.88 6.99,19.84 3.81,19.84
N$59
  Bottom 0.406: 25.08,14.68 25.64,13.89
N$60  (1 unrouted)
  Bottom 0.305: 0.38,14.21 0.38,31.58 | 2.63,14.21 2.63,31.58
N$61  (1 unrouted)
  Top 0.305: 37.07,10.57 25.17,10.57 | 37.07,6.5 29.22,6.5
N$81
  Top 0.305: PIC1.9 28.91,24.22 28.89,24.21 28.89,24.13 29.37,23.65 C34.1 29.37,21.51 Q1.1
N$188  (via drill 0.61)
  Top 0.305: PIC1.27 20.02,32.69 v20.95,31.75 | v20.72,40.88 21.07,40.52 29.8,40.52 v30.16,40.88 | 38.71,43.97 IC1.3 | IC1.3 IC1.2 38.8,42.96 v38.77,43.42 | IC1.3 38.77,42.67 38.81,42.62
  Bottom 0.305: CN3.5 36.43,24.77 35.8,25.36 35.8,31.66 35.24,32.22 35.24,36.27 32.69,38.82 32.69,41.25 32.03,41.91 31.32,41.91 31.23,41.87 | v20.95,31.75 20.32,32.38 20.32,40.48 v20.72,40.88 | v30.16,40.88 30.24,40.88 31.23,41.87 | 34.53,43.97 38.26,43.97 v38.77,43.42 39.12,43.31 SJ2.3 | 34.53,43.97 33.3,43.97 31.23,41.87 | SJ3.3 34.65,43.85 34.53,43.97
N$223
  Top 0.305: C38.2 25.09,24.38 PIC1.6
N$357  (via drill 0.61)  (1 unrouted)
  Top 0.305: 37.07,26.43 CN3.4 37.11,26.43 35.24,28.3 28.77,28.3 28.26,27.78 25.6,27.78 25.24,27.42 24.25,27.42 23.65,28.02 19.45,28.02 18.85,27.42 v18.26,27.46 | PIC1.28 18.75,32.56 17.3,31.11 16.51,30.16 v16.51,28.73 | IC1.4 38.7,45.36 37.98,45.36 37.42,44.81 37.42,42.11 38.04,41.49 | 38.26,41.49 IC1.1 38.74,41.51 37.86,41.51 v37.03,40.68
  Bottom 0.305: v18.26,27.46 17.14,28.57 v16.51,28.73 | v37.03,40.68 36.43,40.08 | CN3.4 38.54,27.66 38.54,35.04 36.43,37.15 36.43,40.08 | SJ3.2 34.65,41.08 35.72,40.01 36.35,40.01 36.43,40.08
VDD
  Bottom 0.406: U$6.P$2 22.88,9.21 | 22.88,9.21 22.88,9.39 | 22.88,9.39 24.77,11.27 24.77,13.86 C4.P+ | 22.88,9.39 22.86,8.97 | 19.96,9.17 18.1,11.03 14.21,11.03 13.34,10.16 13.34,9.13 D1.P$2 | U$2.P$2 16.62,5.83 19.96,9.17 | 19.96,9.17 20,9.21 22.88,9.21
VSS  (via drill 0.61)
  Top 0.406: v11.83,13.41 13.34,11.91 13.34,3.73 13.73,3.33 | 13.73,3.33 13.73,3.35 U$2.P$1 | U$2.P$1 14.57,2.51 | 13.73,3.33 14.07,3 U$2.P$1
  Bottom 0.406: U$2.P$1 15.73,1.35 18.35,1.35 U$6.P$1 22.25,1.43 25.96,1.43 27.07,2.54 27.07,12.3 27.06,12.31 C4.P- | X2.7 12.38,19.68 11.83,19.13 v11.83,13.41
(copper drawn outside any net)
  shapes: Bottom area x3, Bottom circle x1, Top area x4, Top circle x5

### Text on the board
Top: TOP | + | CanLogger V2.0 | TEQ NARVAL / 2017 | V2.0 | +42V-
Bottom: BOT | TEQ NARVAL 2017 | CanLogger V2.0 | -42V+
tNames: CAN | G K L | +12 5 G | 5V | 12V | -42V+ | C0 1 2 3 4 5 6 7 B0 1 4 5 A0 1 2
bNames: L K G | +12 5 G | +42V- | C0 1 2 3 4 5 6 7 B0 1 4 5 A0 1 2
tStop: V2.0